# EAGLE design F408HS_control (EAGLE 9.6.2)
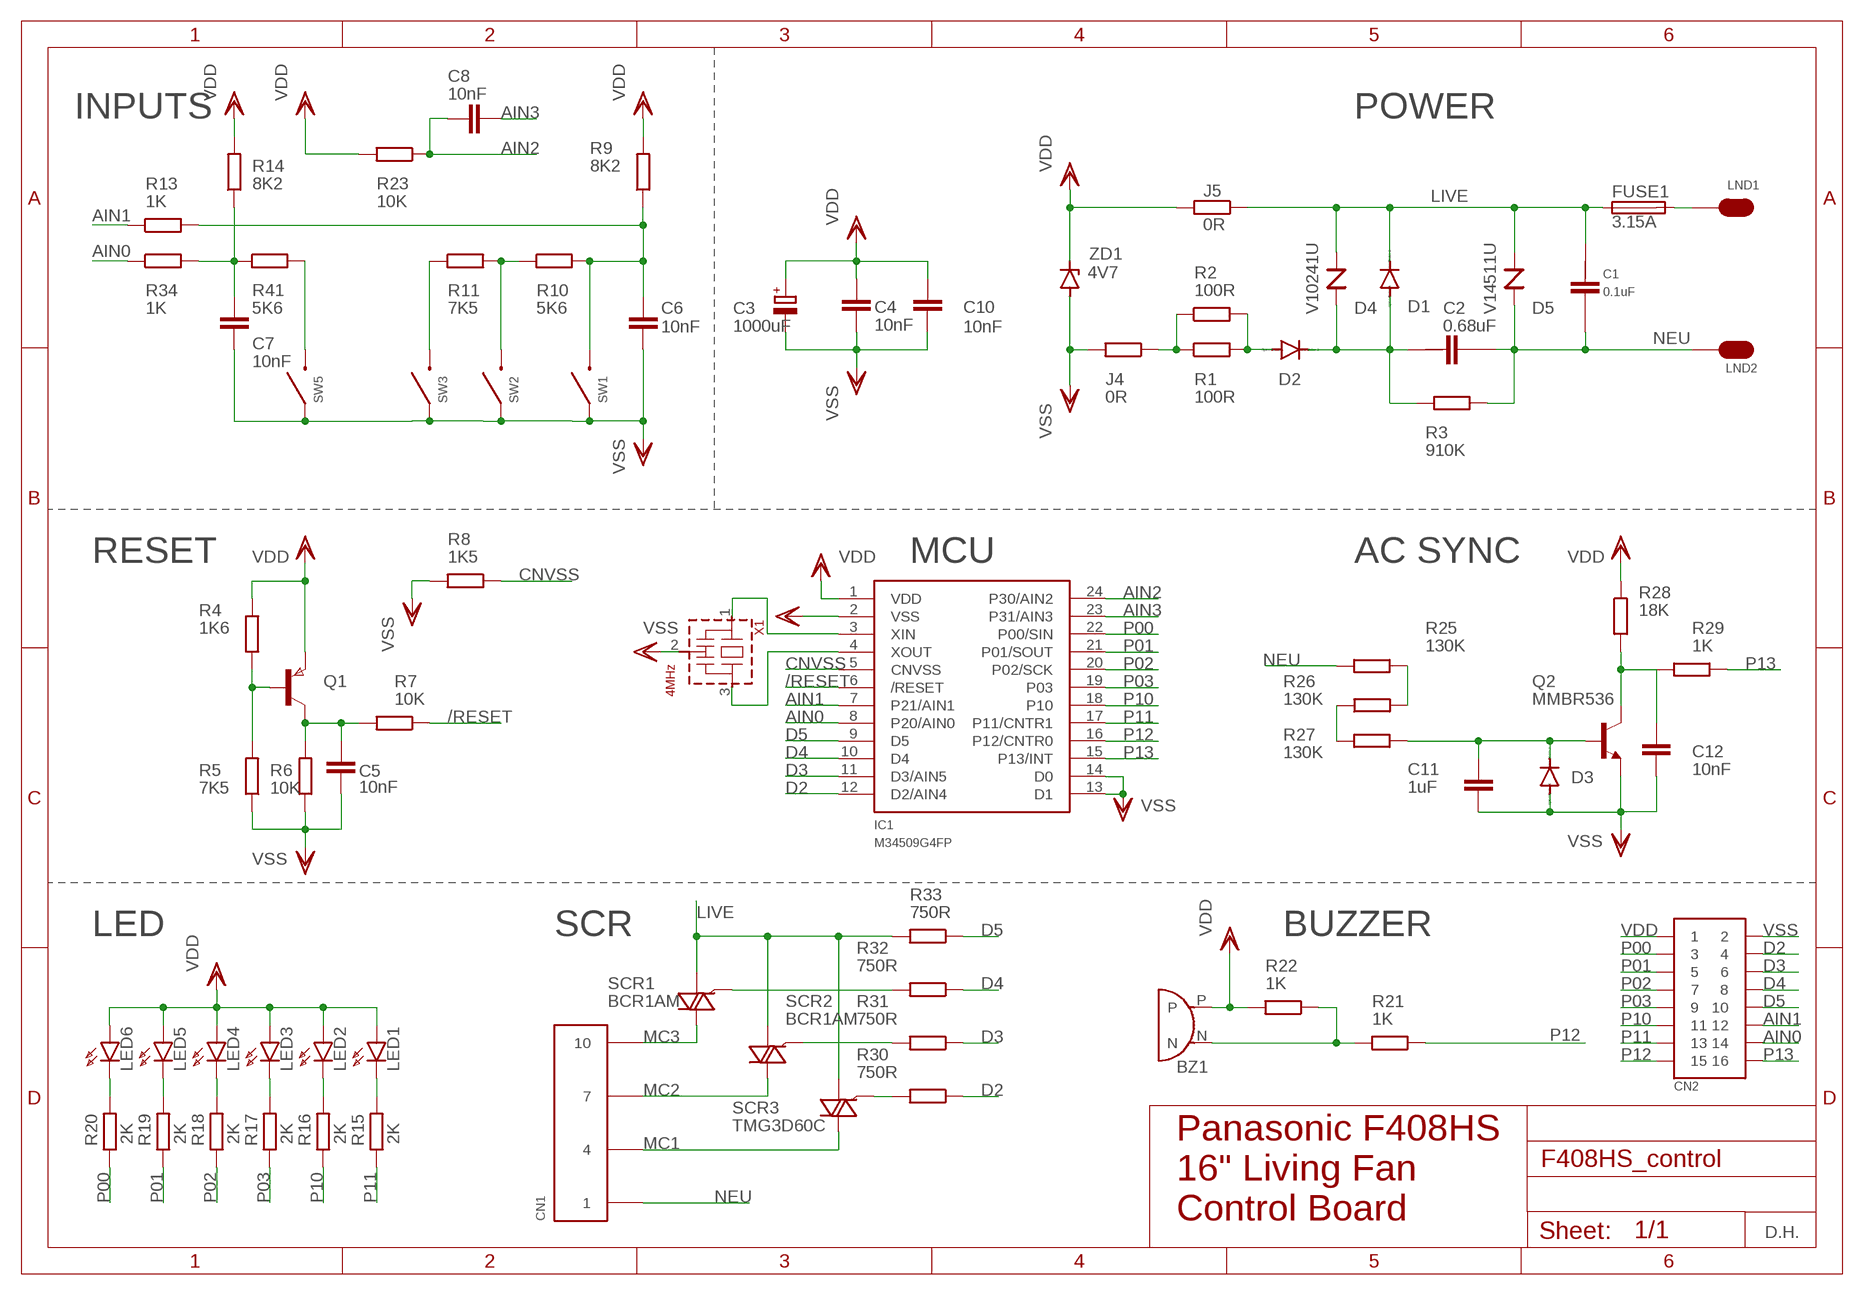
[diagram p0: schematic, sheet 1]
FRAME1 (A4L-LOC): DRAFTED: D.H.

## Parts
BZ1  BUZZER  [BUZZER]
C1  0.1uF  ECQU2A104  [ECQU2A104]
C2  0.68uF  ECQUL2A648KL  [ECQU2A684]
C3  1000uF  CPOL-EUB45181B  [B45181B]
C4  10nF  C-EUC0805  [C0805]
C5  10nF  C-EUC0805  [C0805]
C6  10nF  C-EUC0805  [C0805]
C7  10nF  C-EUC0805  [C0805]
C8  10nF  C-EUC0805  [C0805]
C10  10nF  C-EUC0805  [C0805]
C11  1uF  C-EUC0805  [C0805]
C12  10nF  C-EUC0805  [C0805]
CN1  SC25-10WS  [SC25-10WS]
CN2  HEADER16  [PAK100/2500-16]
D1  SD103CWS-7-F  1N4004  [DO41-10]
D2  SD103CWS-7-F  1N4004  [DO41-10]
D3  DIODE-SOD106-W  [SOD106-W]
D4  V10241U  TVS  [E14-S1]
D5  V14511U  TVS  [E14-S1]
FUSE1  3.15A  FUSE  [FUSE]
IC1  M34509G4FP  [SSOP24]
J4  0R  R-EU_M0805  [M0805]
J5  0R  R-EU_M0805  [M0805]
LED1  LED_PTH_HORIZ  [LED_HORIZ]
LED2  LED_PTH_HORIZ  [LED_HORIZ]
LED3  LED_PTH_HORIZ  [LED_HORIZ]
LED4  LED_PTH_HORIZ  [LED_HORIZ]
LED5  LED_PTH_HORIZ  [LED_HORIZ]
LED6  LED_PTH_HORIZ  [LED_HORIZ]
LND1  LND  [LND]
LND2  LND  [LND]
Q1  PNPSOT23  [SOT-23]
Q2  MMBR536  [SOT23]
R1  100R  R-EU_0204/7  [0204/7]
R2  100R  R-EU_0204/7  [0204/7]
R3  910K  R-EU_0204/7  [0204/7]
R4  1K6  R-EU_M0805  [M0805]
R5  7K5  R-EU_M0805  [M0805]
R6  10K  R-EU_M0805  [M0805]
R7  10K  R-EU_M0805  [M0805]
R8  1K5  R-EU_M0805  [M0805]
R9  8K2  R-EU_M0805  [M0805]
R10  5K6  R-EU_M0805  [M0805]
R11  7K5  R-EU_M0805  [M0805]
R13  1K  R-EU_M0805  [M0805]
R14  8K2  R-EU_M0805  [M0805]
R15  2K  R-EU_M0805  [M0805]
R16  2K  R-EU_M0805  [M0805]
R17  2K  R-EU_M0805  [M0805]
R18  2K  R-EU_M0805  [M0805]
R19  2K  R-EU_M0805  [M0805]
R20  2K  R-EU_M0805  [M0805]
R21  1K  R-EU_M0805  [M0805]
R22  1K  R-EU_M0805  [M0805]
R23  10K  R-EU_M0805  [M0805]
R25  130K  R-EU_R0805  [R0805]
R26  130K  R-EU_R0805  [R0805]
R27  130K  R-EU_R0805  [R0805]
R28  18K  R-EU_M0805  [M0805]
R29  1K  R-EU_M0805  [M0805]
R30  750R  R-EU_M0805  [M0805]
R31  750R  R-EU_M0805  [M0805]
R32  750R  R-EU_M0805  [M0805]
R33  750R  R-EU_M0805  [M0805]
R34  1K  R-EU_M0805  [M0805]
R41  5K6  R-EU_M0805  [M0805]
SCR1  BCR1AM  [TO92]
SCR2  BCR1AM  [TO92]
SCR3  TMG3D60C  TIC225S  [TO220DS]
SW1  EVQ11  [EVQ11]
SW2  EVQ11  [EVQ11]
SW3  EVQ11  [EVQ11]
SW5  EVQ11  [EVQ11]
X1  4MHz  CSTLS_G  [CSTLS_G8]
ZD1  DDZ4V7ASF-7  1N821  [DO35Z10]

## Nets
/RESET: IC1.6(/RESET) R7.1
AIN0: CN2.14 IC1.8(P20/AIN0) R34.1
AIN1: CN2.12 IC1.7(P21/AIN1) R13.1
AIN2: C8.1 IC1.24(P30/AIN2) R23.1
AIN3: C8.2 IC1.23(P31/AIN3)
CNVSS: IC1.5(CNVSS) R8.1
D2: CN2.4 IC1.12(D2/AIN4) R30.1
D3: CN2.6 IC1.11(D3/AIN5) R31.1
D4: CN2.8 IC1.10(D4) R32.1
D5: CN2.10 IC1.9(D5) R33.1
LIVE [mot_power]: C1.P$1 D1.C D4.P$1 D5.P$1 FUSE1.P$1 J5.1 R33.2 SCR1.1(A1) SCR2.1(A1) SCR3.A1
MC1 [mot_power]: CN1.P$4 SCR3.A2
MC2 [mot_power]: CN1.P$7 SCR2.3(A2)
MC3 [mot_power]: CN1.P$10 SCR1.3(A2)
N$1: R25.1 R26.2
N$2: C12.2 Q2.3(C) R28.2 R29.2
N$3: R26.1 R27.2
N$4: C2.P$1 D1.A D2.C D4.P$2 R3.1
N$5: C6.2 R9.1 R10.2 R13.2 SW1.P$2
N$6: C11.2 D3.C Q2.1(B) R27.1
N$7: D2.A R1.2 R2.2
N$8: R30.2 SCR3.G
N$9: Q1.3(B) R4.1 R5.2
N$10: C5.1 Q1.1(C) R6.2 R7.2
N$11: R10.1 R11.2 SW2.P$2
N$12: R11.1 SW3.P$2
N$13: R41.2 SW5.P$2
N$14: C7.1 R14.1 R34.2 R41.1
N$15: LED6.N(K) R20.2
N$16: LED5.N(K) R19.2
N$17: LED4.N(K) R18.2
N$18: LED3.N(K) R17.2
N$19: LED2.N(K) R16.2
N$20: LED1.N(K) R15.2
N$21 [mot_power]: FUSE1.P$2 LND1.P$1
N$22 [power]: J4.1 R1.1 R2.1
N$24: R32.2 SCR1.2(G)
N$25: R31.2 SCR2.2(G)
N$27: BZ1.N R21.2 R22.1
N$28: IC1.3(XIN) X1.1
N$29: IC1.4(XOUT) X1.3
NEU [mot_power]: C1.P$2 C2.P$2 CN1.P$1 D5.P$2 LND2.P$1 R3.2 R25.2
P00: CN2.3 IC1.22(P00/SIN) R20.1
P01: CN2.5 IC1.21(P01/SOUT) R19.1
P02: CN2.7 IC1.20(P02/SCK) R18.1
P03: CN2.9 IC1.19(P03) R17.1
P10: CN2.11 IC1.18(P10) R16.1
P11: CN2.13 IC1.17(P11/CNTR1) R15.1
P12: CN2.15 IC1.16(P12/CNTR0) R21.1
P13: CN2.16 IC1.15(P13/INT) R29.1
VDD [power]: BZ1.P C3.+ C4.1 C10.1 CN2.1 IC1.1(VDD) J5.2 LED1.P(A) LED2.P(A) LED3.P(A) LED4.P(A) LED5.P(A) LED6.P(A) Q1.2(E) R4.2 R9.2 R14.2 R22.2 R23.2 R28.1 ZD1.C
VSS [power]: C3.- C4.2 C5.2 C6.1 C7.2 C10.2 C11.1 C12.1 CN2.2 D3.A IC1.2(VSS) IC1.13(D1) IC1.14(D0) J4.2 Q2.2(E) R5.1 R6.1 R8.2 SW1.P$1 SW2.P$1 SW3.P$1 SW5.P$1 X1.2(VSS) ZD1.A

## Notes on the sheet
- INPUTS | POWER
- 4V7
- RESET | MCU | AC SYNC
- LED | SCR | BUZZER
- Panasonic F408HS 
  16" Living Fan
  Control Board

## Library data of the parts
BZ1 = panasonic_F408HS:BUZZER
C1 = panasonic_F408HS:ECQU2A104
C2 = panasonic_F408HS:ECQUL2A648KL: Panasonic ECQUL Polyester Film Capacitor, 275V ac, ±10%, 680nF RS Stock No.: 869-7431 <https://sg.rs-online.com/web/p/film-capacitors/8697431>
C3 = rcl:CPOL-EU: POLARIZED CAPACITOR, European symbol; SPICEPREFIX: C
C4-C8 C10-C12 = rcl:C-EU: CAPACITOR, European symbol; SPICEPREFIX: C
CN1 = panasonic_F408HS:SC25-10WS
CN2 = panasonic_F408HS:HEADER16
D1 D2 = diode:1N4004: DIODE general purpose rectifier, 1 A
D3 = diode:DIODE-: DIODE
D4 D5 = panasonic_F408HS:TVS: Panasonic "ZNR" Transient/Surge Absorbers" Type name: E14511
FUSE1 = panasonic_F408HS:FUSE
IC1 = panasonic_F408HS:M34509G4FP
J4 J5 R1-R11 R13-R23 R25-R34 R41 = rcl:R-EU_: RESISTOR, European symbol; SPICEPREFIX: R
LED1-LED6 = panasonic_F408HS:LED_PTH_HORIZ
LND1 LND2 = panasonic_F408HS:LND
Q1 = zetex:PNPSOT23: PNP TRANSISTOR; MPN: DSS20200L-7; OC_FARNELL: unknown; OC_NEWARK: 25R4554
Q2 = panasonic_F408HS:MMBR536
SCR1 SCR2 = panasonic_F408HS:BCR1AM
SCR3 = triac:TIC225S: TRIAC
SW1-SW3 SW5 = panasonic_F408HS:EVQ11
X1 = murata-resonators:CSTLS_G: Ceramic resonator 2.00 to 10.00 MHz
ZD1 = diode:1N821: Reference DIODE temperature compensated, 6,2 V

## Net classes
0 default: width 0.508 mm, clearance 0.254 mm
1 power: width 0.508 mm, clearance 0.254 mm
2 mot_power: width 1.27 mm, clearance 0.508 mm

## Board
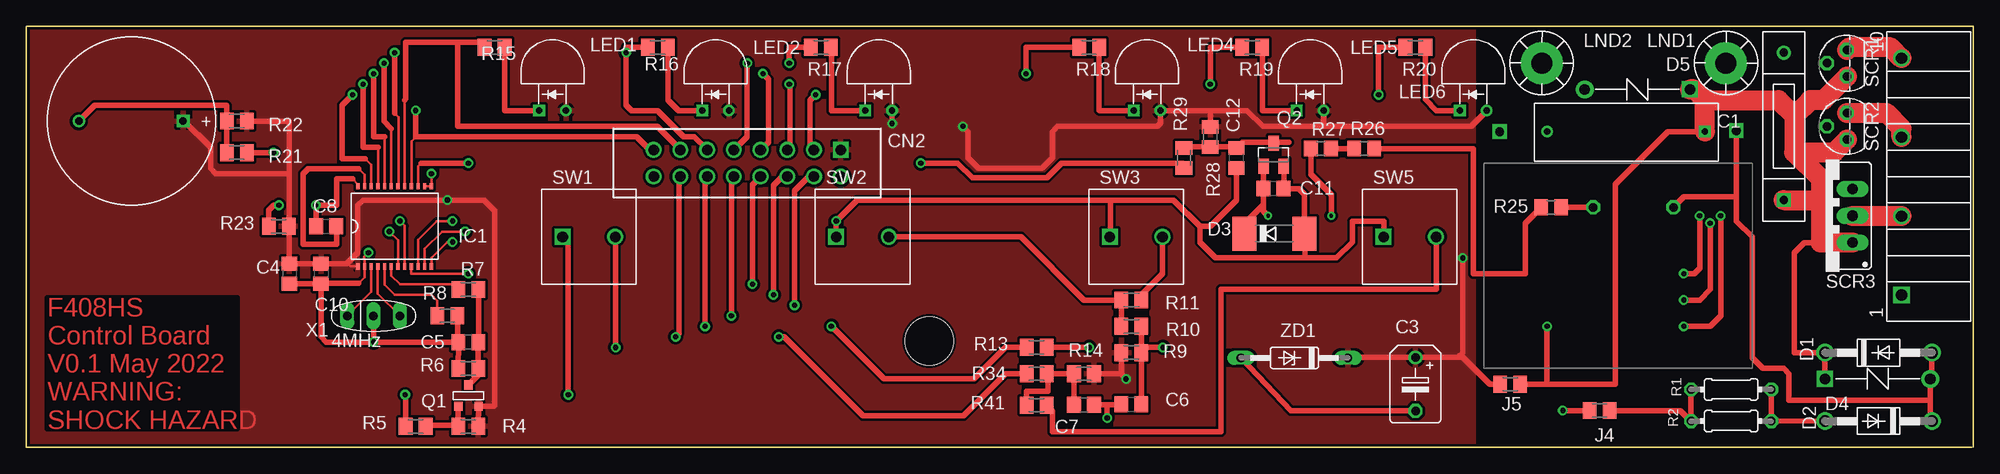
[diagram p1: board, top side]
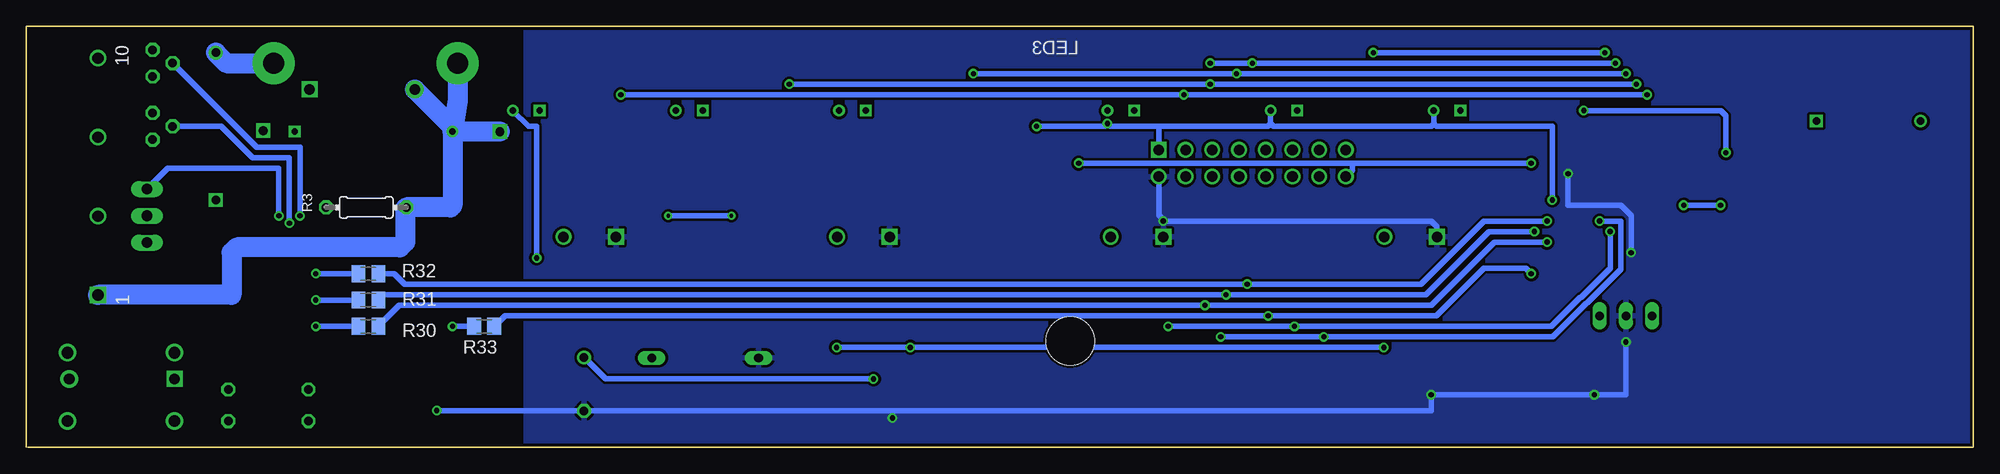
[diagram p2: board, bottom side, seen from below]

Size 185 x 40 mm. Coordinates in mm from the lower left corner, seen from the top.
Outline: 184.86,0 0,0 0,40 185,40 185,0
Copper layers (1*16): Top 0.035mm / dielectric 1.5mm / Bottom 0.035mm
Design rules "default *": minimum track width 6mil, minimum drill 0.35mm, track to track 9mil, track to pad 9mil, pad to pad 9mil, via to via 9mil, smd to smd 7mil, copper to edge 10mil, drill to drill 6mil, minimum pad ring 10mil, minimum via ring 8mil, stop-mask expansion 4mil, vias tented up to drill 0mil, thermal gap 10mil
Holes 4.6 mm at 85.8,10.1
tRestrict: area 139.5,31 to 141,40; area 138,17 to 139,30.5; area 138,8 to 139,12

### Footprints (pad centres in the part's own frame; a part is rotated, then mirrored left to right if it is on the bottom)
BUZZER = drill 0.7: N 5,0 | drill 0.7 square: P -4.9,0
ECQU2A104 = drill 0.6 square: P$1 0,0 | drill 0.6: P$2 15,0
ECQU2A684 = drill 0.85 square: P$1 1.5,-3.1; P$2 24,-3
B45181B = drill 0.813: + -2.54,0 | drill 0.813 octagon: - 2.54,0
C0805 = smd 1.3 x 1.5: 1 -0.95,0; 2 0.95,0
SC25-10WS = drill 1.05 square: P$1 22.5,0 | drill 1.05: P$4 15,0; P$7 7.5,0; P$10 0,0
PAK100/2500-16 = drill 1 pad 1.422 square: 1 -8.89,-1.27 | drill 1 pad 1.422: 2 -8.89,1.27; 3 -6.35,-1.27; 4 -6.35,1.27; 5 -3.81,-1.27; 6 -3.81,1.27; 7 -1.27,-1.27; 8 -1.27,1.27; 9 1.27,-1.27; 10 1.27,1.27; 11 3.81,-1.27; 12 3.81,1.27; 13 6.35,-1.27; 14 6.35,1.27; 15 8.89,-1.27; 16 8.89,1.27
DO41-10 = drill 1.118: A 5.08,0; C -5.08,0
SOD106-W = smd 2.3 x 3.2: A 2.85,0; C -2.85,0
E14-S1 = drill 1.01 square: P$1 -5.08,0 | drill 1.01 pad 1.7: P$2 4.92,0
FUSE = drill 0.8 square: P$1 0,0 | drill 0.8: P$2 14,0
SSOP24 = smd 0.305 x 0.61: 1 -3.493,-3.81; 2 -2.857,-3.81; 3 -2.223,-3.81; 4 -1.587,-3.81; 5 -0.953,-3.81; 6 -0.318,-3.81; 7 0.318,-3.81; 8 0.953,-3.81; 9 1.587,-3.81; 10 2.223,-3.81; 11 2.857,-3.81; 12 3.493,-3.81; 13 3.493,3.81; 14 2.857,3.81; 15 2.223,3.81; 16 1.587,3.81; 17 0.953,3.81; 18 0.318,3.81; 19 -0.318,3.81; 20 -0.953,3.81; 21 -1.587,3.81; 22 -2.223,3.81; 23 -2.857,3.81; 24 -3.493,3.81
M0805 = smd 1.3 x 1.6: 1 -0.95,0; 2 0.95,0
LED_HORIZ = drill 0.6 square: N -1.27,0 | drill 0.6: P 1.27,0
LND = drill 2 pad 4: P$1 0,0
SOT-23 = smd 0.787 x 0.889: 1 0.025,-1.016; 2 -0.94,1.016; 3 0.991,1.016
SOT23 = smd 1 x 1.4: 1 -0.95,-1.1; 2 0.95,-1.1; 3 0,1.1
0204/7 = drill 0.813 octagon: 1 -3.81,0; 2 3.81,0
R0805 = smd 1.3 x 1.5: 1 -0.95,0; 2 0.95,0
TO92 = drill 0.813 octagon: 1 -1.27,0; 2 0,1.905; 3 1.27,0
TO220DS = drill 1.016 long: A1 -2.54,-2.54; A2 0,-2.54; G 2.54,-2.54
EVQ11 = drill 1 square: P$1 -2.54,0 | drill 1: P$2 2.46,0
CSTLS_G8 = drill 0.813 long: 1 -2.5,0; 2 0,0; 3 2.5,0
DO35Z10 = drill 0.813 long: A 5.08,0; C -5.08,0

### Placement (x,y rotation side)
BZ1  10,31 180 top
C1  159.5,30 180 top
C2  164,27 180 top
C3  132,6 270 top
C4  25,16.5 270 top
C5  42,10 180 top
C6  105,4.11 0 top
C7  100.5,4.04 0 top
C8  28.5,21 0 top
C10  28,16.5 270 top
C11  118.51,24.59 180 top
C12  115,27.5 90 top
CN1  178.19,36.98 270 top
CN2  68.5,27 180 top
D1  176,9 0 top
D2  176,2.5 180 top
D3  118.6,20.3 0 top
D4  176,6.5 0 top
D5  153,34 180 top
FUSE1  167,23.5 90 top
IC1  35,21 0 top
J4  149.5,3.5 180 top
J5  141,6 180 top
LED1  50,32 0 top
LED2  65.5,32 0 top
LED3  81,32 0 top
LED4  106.5,32 0 top
LED5  122,32 0 top
LED6  137.5,32 0 top
LND1  161.5,36.5 180 top
LND2  144,36.5 180 top
Q1  42.04,4.92 180 top
Q2  118.51,27.8 0 top
R1  162,5.5 0 top
R2  162,2.5 0 top
R3  152.7,22.8 0 bottom
R4  42,2 0 top
R5  37,2 0 top
R6  42,7.5 0 top
R7  42,15 0 top
R8  40,12.5 0 top
R9  105,9 180 top
R10  105,11.5 0 top
R11  105,14 180 top
R13  96,9.5 0 top
R14  100.5,7 0 top
R15  44.5,38 0 top
R16  60,38 0 top
R17  75.5,38 0 top
R18  101,38 0 top
R19  116.5,38 0 top
R20  132,38 0 top
R21  20,28 180 top
R22  20,31 0 top
R23  24,21 0 top
R25  144.9,22.8 0 top
R26  127.14,28.39 0 top
R27  123.01,28.39 0 top
R28  112.5,29.5 270 top
R29  110,27.5 90 top
R30  152.5,11.5 180 bottom
R31  152.5,14 180 bottom
R32  152.5,16.5 180 bottom
R33  141.5,11.5 180 bottom
R34  96,7 0 top
R41  96,4 0 top
SCR1  173,36.5 90 top
SCR2  173,30.5 90 top
SCR3  171,22 90 top
SW1  53.5,20 0 top
SW2  79.5,20 0 top
SW3  105.5,20 0 top
SW5  131.5,20 0 top
X1  33,12.5 0 top
ZD1  120.5,8.5 180 top

### Tracks (layer width: path | path; a pad name or v marks a point on that pad's centre or on a via)
/RESET
  Top 0.254: IC1.6 34.68,16.32 35.5,15.5 40.55,15.5 R7.1
AIN0  (via drill 0.5 pad 0.9)
  Top 0.254: IC1.8 35.95,21.05 v35.5,21.5
  Top 0.508: R34.1 93.05,7 89.05,3 79.5,3 72,10.5 v71.5,10.5 | v61.7,10.5 62.05,10.85 62.05,25.33 62.15,25.43 CN2.14
  Bottom 0.508: v71.5,10.5 v61.7,10.5 39.92,10.5 33.5,16.92 33.5,21.5 v35.5,21.5
AIN1  (via drill 0.5 pad 0.9)
  Top 0.254: IC1.7 35.32,19.68 v34.5,20.5
  Top 0.508: R13.1 93.05,9.5 90.05,6.5 81.5,6.5 v76.5,11.5 | CN2.12 64.69,25.63 64.49,25.43 v64.49,11.51 v64.5,11.5
  Bottom 0.508: v76.5,11.5 v64.5,11.5 40.08,11.5 37.32,14.26 37.24,14.26 34.5,17 v34.5,20.5
AIN2  (via drill 0.5 pad 0.9)
  Top 0.254: IC1.24 31.51,25.01 31.02,25.5
  Top 0.508: R23.1 23.05,22.55 23.5,23 v24,23 | 31.02,25.5 29.5,25.5 29.5,23 v27.5,23 27.55,22.95 C8.1
  Bottom 0.508: v24,23 v27.5,23
AIN3
  Top 0.254: IC1.23 32.14,25.9 31.56,26.48
  Top 0.508: 31.56,26.48 26.78,26.48 26.3,26 26.3,19.3 29.5,19.3 29.5,20.95 C8.2
CNVSS
  Top 0.254: IC1.5 34.05,15.45 35,14.5 38.5,14.5 39.05,13.95 R8.1
D2  (via drill 0.5 pad 0.9)
  Top 0.254: IC1.12 38.49,17.99 40,19.5 v40.5,19.5
  Top 0.508: v73,13.5 73,24.38 74.35,25.73 CN2.4
  Bottom 0.508: v40.5,19.5 45.5,19.5 51.5,13.5 v73,13.5 149.55,13.5 R30.1
D3  (via drill 0.5 pad 0.9)
  Top 0.254: IC1.11 37.86,18.86 39.5,20.5 v41.7,20.5
  Top 0.508: v71,14.5 71,24.92 71.81,25.73 CN2.6
  Bottom 0.508: v41.7,20.5 46,20.5 52,14.5 v71,14.5 151.05,14.5 R31.1
D4  (via drill 0.5 pad 0.9)
  Top 0.254: IC1.10 37.22,19.72 39,21.5 v40.5,21.5
  Top 0.508: v69,15.5 69,25 69.04,25 CN2.8
  Bottom 0.508: v40.5,21.5 46.5,21.5 52.5,15.5 v69,15.5 149.05,15.5 150.05,16.5 R32.1
D5  (via drill 0.5 pad 0.9)
  Top 0.254: v42,16.5 36.59,16.5 IC1.9
  Top 0.508: v67,12.5 67,25.46 67.23,25.69 CN2.10
  Bottom 0.254: R33.1 140.5,11.5
  Bottom 0.508: v42,16.5 42.5,17 46.5,17 51,12.5 v67,12.5 139.5,12.5 140.5,11.5
LIVE  (via drill 0.5 pad 0.9)
  Top 0.508: v144.5,11.5 144.5,6 J5.1 151,6 151,25 156,30 C1.P$1 | 170.5,19.46 168.96,19.46 168,18.5 168,9 D1.C D4.P$1
  Top 1.9: SCR3.A1 170.5,19.46 170.5,23.5 | 168,31.5 168,28 | 168,28 170.5,25.5 170.5,23.5 | 168,31.5 166.5,33 160,33 159.5,32.5 C1.P$1 159.5,33 158.5,34 D5.P$1 | FUSE1.P$1 170.5,23.5 | SCR2.1 171.77,28 168,28 | SCR1.1 170.77,33 169.5,33 168,31.5
  Bottom 0.508: v144.5,11.5 R33.2
MC1
  Top 1.9: SCR3.A2 178.16,22 CN1.P$4
MC2
  Top 1.9: SCR2.3 176.73,31.77 178.19,30.31 CN1.P$7
MC3
  Top 1.9: SCR1.3 173.23,38 177.16,38 CN1.P$10
N$1
  Top 0.508: R26.2 137.5,28.39 137.5,16.5 142.45,16.5 142.45,21.3 R25.1
N$2
  Top 0.508: 120,29 118.61,29 Q2.3 118.4,29 115.55,29 C12.2 114.9,28.55 R28.2 110.1,28.55 R29.2
N$3
  Top 0.508: R26.1 R27.2
N$4
  Top 0.508: 162.5,23.8 157.51,23.8 R3.1 | 162.5,23.8 162.5,21.5 164,20 164,8.5 165,7.5 167,7.5 167.5,7 167.5,4.5 180.92,4.5 | 162.5,23.8 C2.P$1 | 180.92,4.5 180.92,2.66 D2.C | D1.A 181.08,6.66 D4.P$2 180.92,4.5
N$5  (via drill 0.5 pad 0.9)
  Top 0.508: R10.2 105.95,9.5 | 105.95,9.5 R9.1 C6.2 | v108,9.5 105.95,9.5 | R13.2 v101,9.5 | v56,9.5 56,19.96 SW1.P$2
  Bottom 0.508: v108,9.5 v101,9.5 v56,9.5
N$6  (via drill 0.35)
  Top 0.508: Q2.1 C11.2 117.56,23.06 | 117.56,23.06 116,21.5 116,20.55 D3.C | R27.1 122.06,25.94 124,24 v124,22 | v118,22 117.56,22.44 117.56,23.06
  Bottom 0.508: v124,22 v118,22
N$7
  Top 0.508: R1.2 R2.2 165.83,2.52 D2.A
N$8  (via drill 0.5 pad 0.9)
  Top 0.508: v161,22 161,12.5 160,11.5 v157.5,11.5
  Bottom 0.508: v161,22 161,26.5 171.58,26.5 SCR3.G | v157.5,11.5 R30.2
N$9
  Top 0.508: Q1.3 41.05,2.09 | 41.05,2.09 R4.1 | R5.2 38.04,2.09 41.05,2.09
N$10
  Top 0.254: R7.2 43,14.95
  Top 0.508: 43,14.95 43,9.91 C5.1 R6.2 42.95,6.87 Q1.1
N$11
  Top 0.508: R10.1 R11.2 100.5,14 94.5,20 SW2.P$2
N$12
  Top 0.508: SW3.P$2 107.96,16.5 105.95,14.49 R11.1
N$13
  Top 0.508: R41.2 97.5,3.45 97.5,1.5 113.5,1.5 113.5,15 134,15 134,19.96 SW5.P$2
N$14
  Top 0.508: R41.1 95.05,5.33 97.08,5.33 97.08,6.87 R34.2 R14.1 C7.1
N$15
  Top 0.508: R20.2 132.95,33.05 134,32 LED6.N
N$16
  Top 0.508: R19.2 117.45,32.05 117.5,32 LED5.N
N$17
  Top 0.508: R18.2 101.95,32.05 102,32 LED4.N
N$18
  Top 0.508: R17.2 76.5,37.95 76.5,32 LED3.N
N$19
  Top 0.508: R16.2 61,37.95 61,33 62,32 LED2.N
N$20
  Top 0.508: LED1.N 45.5,32 45.45,32.05 R15.2
N$21
  Bottom 1.9: FUSE1.P$2 166,36.5 LND1.P$1
N$22
  Top 0.508: J4.1 157.19,3.5 R2.1 R1.1
N$24  (via drill 0.5 pad 0.9)
  Top 0.508: v159,22 159,17 158.5,16.5 v157.5,16.5
  Bottom 0.508: SCR1.2 163.09,28.5 159,28.5 v159,22 | v157.5,16.5 R32.2
N$25  (via drill 0.5 pad 0.9)
  Top 0.508: v157.5,14 159,14 160,15 v160,21.3
  Bottom 0.508: SCR2.2 166.5,30.5 163.5,27.5 160,27.5 v160,21.3 | v157.5,14 R31.2
N$27
  Top 0.508: R21.2 R22.1 19.05,32.45 19,32.5 6.5,32.5 BZ1.N
N$28
  Top 0.254: IC1.3 32.78,14.78 X1.1
N$29
  Top 0.254: X1.3 33.4,14.6 33.4,17.18 IC1.4
NEU
  Top 0.508: R25.2 R3.2
  Bottom 1.9: C1.P$2 144.5,23 144.7,22.8 R3.2 149,22.69 149,19.5 149.5,19 165,19 165.5,18.5 165.5,14.5 165.52,14.48 CN1.P$1 | C2.P$2 C1.P$2 | LND2.P$1 144,33 C1.P$2 | D5.P$2 144.5,30.42 C1.P$2
P00  (via drill 0.5 pad 0.9)
  Top 0.254: IC1.22 32.78,26.83 32.21,27.4
  Top 0.508: R20.1 128.5,38 v128.5,33.5 | v75,33.5 74.49,32.99 74.49,28.41 74.63,28.27 CN2.3 | v31,33.5 30,32.5 30,27.4 32.21,27.4
  Bottom 0.508: v128.5,33.5 v75,33.5 v31,33.5
P01  (via drill 0.5 pad 0.9)
  Top 0.254: IC1.21 33.41,28.5
  Top 0.508: v112.5,34.5 112.5,38 R19.1 | v32,34.5 32,28.5 33.41,28.5 | v72.5,34.5 72.55,34.45 72.55,28.47 72.01,28.47 72.21,28.27 CN2.5
  Bottom 0.508: v112.5,34.5 v72.5,34.5 v32,34.5
P02  (via drill 0.5 pad 0.9)
  Top 0.254: 34.05,29.5 IC1.20
  Top 0.508: v95,35.5 95,38 R18.1 | v33,35.5 33,29.5 34.05,29.5 | v70,35.5 70.51,34.99 70.51,28.97 69.81,28.27 CN2.7
  Bottom 0.508: v95,35.5 v70,35.5 v33,35.5
P03  (via drill 0.5 pad 0.9)
  Top 0.254: 34.69,30.29 IC1.19
  Top 0.508: R17.1 72.5,38 v72.5,36.5 | v68.5,36.5 68.5,29.5 67.27,28.27 CN2.9 | v34,36.5 34,30.98 34.69,30.29
  Bottom 0.508: v72.5,36.5 v68.5,36.5 v34,36.5
P10  (via drill 0.5 pad 0.9)
  Top 0.254: IC1.18 35.38,24.87 35.38,31.38 35,31.76
  Top 0.508: R16.1 57,38 v57,37.5 57,32.5 57.5,32 60,32 62.47,29.53 63.47,29.53 64.69,28.31 CN2.11 | v35,37.5 35,31.76
  Bottom 0.508: v57,37.5 v35,37.5
P11
  Top 0.254: IC1.17 35.95,33
  Top 0.508: 35.95,33 36.05,33.1 36.05,38.5 41,38.5 | R15.1 43.05,38.5 41,38.5 | 41,38.5 41,30.5 59.92,30.5 CN2.13
P12  (via drill 0.5 pad 0.9)
  Top 0.254: IC1.16 36.6,29.1 37,29.5
  Top 0.508: v37,32 37,29.5 58,29.5 59.23,28.27 CN2.15 | R21.1 v23.5,28
  Bottom 0.508: v23.5,28 23.5,31.5 24,32 v37,32
P13  (via drill 0.5 pad 0.9)
  Top 0.254: IC1.15 37.22,26.72 37.5,27
  Top 0.508: R29.1 109.92,26.98 98.38,26.98 97,25.6 89.9,25.6 88.5,27 v85,27 | 37.5,27 v42,27
  Bottom 0.508: v42,27 59,27 | 59,27 v85,27 | CN2.16 59,26.34 59,27
VDD  (via drill 0.5 pad 0.9)
  Top 0.254: IC1.1 30.81,17.19 30.5,17.5
  Top 0.508: 25,26 25,21.05 R23.2 25,20.95 C4.1 C10.1 30.45,17.45 30.5,17.5 31.5,18.5 31.5,23 32,23.5 v40,23.5 43.5,23.5 44.5,22.5 44.5,4 44.4,3.9 Q1.2 | 25,26 25,31 R22.2 | J5.2 139.05,6 136.51,8.54 136.04,8.54 | 136.04,8.54 C3.+ 125.66,8.54 ZD1.C | v89,30.5 89.5,30 89.5,27.5 90.5,26.5 96.5,26.5 97.5,27.5 97.5,30 98,30.5 107.5,30.5 107.77,30.77 LED4.P 112.5,32 | Q1.2 | Q1.2 R4.2 | 112.5,32 R28.1 | 112.5,32 116,32 117.5,30.5 123.3,30.5 123.3,31.97 LED5.P 123.27,30.5 137.3,30.5 138.77,31.97 LED6.P | R14.2 104,7 v104.5,6.5 104.05,6.95 R9.2 | v82.27,30.77 LED3.P | v136.5,18 136.5,9 136.04,8.54 | BZ1.P 15,31 17.5,28.5 17.5,26.5 18,26 25,26
  Bottom 0.508: v40,23.5 40,30.5 51,30.5 51.27,30.77 LED1.P 51.27,30.73 51.5,30.5 66.5,30.5 66.77,30.77 LED2.P 66.77,30.73 67,30.5 77.5,30.5 | v104.5,6.5 129.96,6.5 C3.+ | 77.5,30.5 82,30.5 v82.27,30.77 82.27,30.73 82.5,30.5 v89,30.5 | LED6.P 137.27,30.5 136.5,30.5 v136.5,18 | CN2.1 77.39,30.39 77.5,30.5
  pour Top: 0,0 0,40 0.5,40 137.5,40 137.5,39.5 137.5,0
VSS  (via drill 0.5 pad 0.9)
  Top 0.254: 31.58,15.58 32.14,16.14 IC1.2 32.14,17.86 32.1,17.9 32.1,18.1 v32.5,18.5 | v38.5,26 IC1.13 IC1.14
  Top 0.508: J4.2 v146,3.5 | C6.1 103.98,4.04 102.7,4.04 | 102.7,4.04 C7.2 | C10.2 28.01,15.58 31.58,15.58 | C4.2 27.91,15.55 27.98,15.56 C10.2 | 41,10 C5.2 41.07,9.95 R6.1 | 41,10 v33,10 | R5.1 36.05,4.95 v36,5 | R8.2 41,12.45 41,10 | X1.2 v33,10 | SW1.P$1 51.5,19.46 v51.5,5 | SW2.P$1 v76.96,21.5 78.96,23.5 103,23.5 | 103,23.5 103,20.04 SW3.P$1 | 103,23.5 109,23.5 111.5,21 | 111.5,21 111.5,19.5 113,18 121.5,18 | 121.5,18 124.5,18 126,19.5 126,21.5 129,21.5 129,20.04 SW5.P$1 | 121.5,18 121.5,20.25 D3.A 121.45,24.05 120.91,24.59 119.5,24.59 | 119.5,24.59 C11.1 | Q2.2 119.5,26.65 119.5,24.59 | C12.1 115,23.5 112.5,21 111.5,21 | ZD1.A 120.15,3.46 C3.- | C10.2 28,10.5 28.5,10 v33,10 | 102.7,4.04 v102.7,2.8
  Bottom 0.508: v146,3.5 145.96,3.46 C3.- 102.7,3.46 | 102.7,3.46 51.54,3.46 51.5,3.5 v51.5,5 v36,5 33,5 v33,10 | SW1.P$1 50.96,20.96 51.5,21.5 v76.96,21.5 76.89,21.57 77.39,22.07 CN2.2 | v102.7,2.8 102.7,3.46 | v32.5,18.5 32.5,22 33.5,23 38.5,23 v38.5,26
  pour Bottom: 0,0 0,40 137.5,40 137.5,0

### Text on the board
Top: F408HS / Control Board / V0.1 May 2022 / WARNING: / SHOCK HAZARD